# EAGLE design STM32F303CBT6_BTN8962TA_V1_0 (EAGLE 8.0.1)
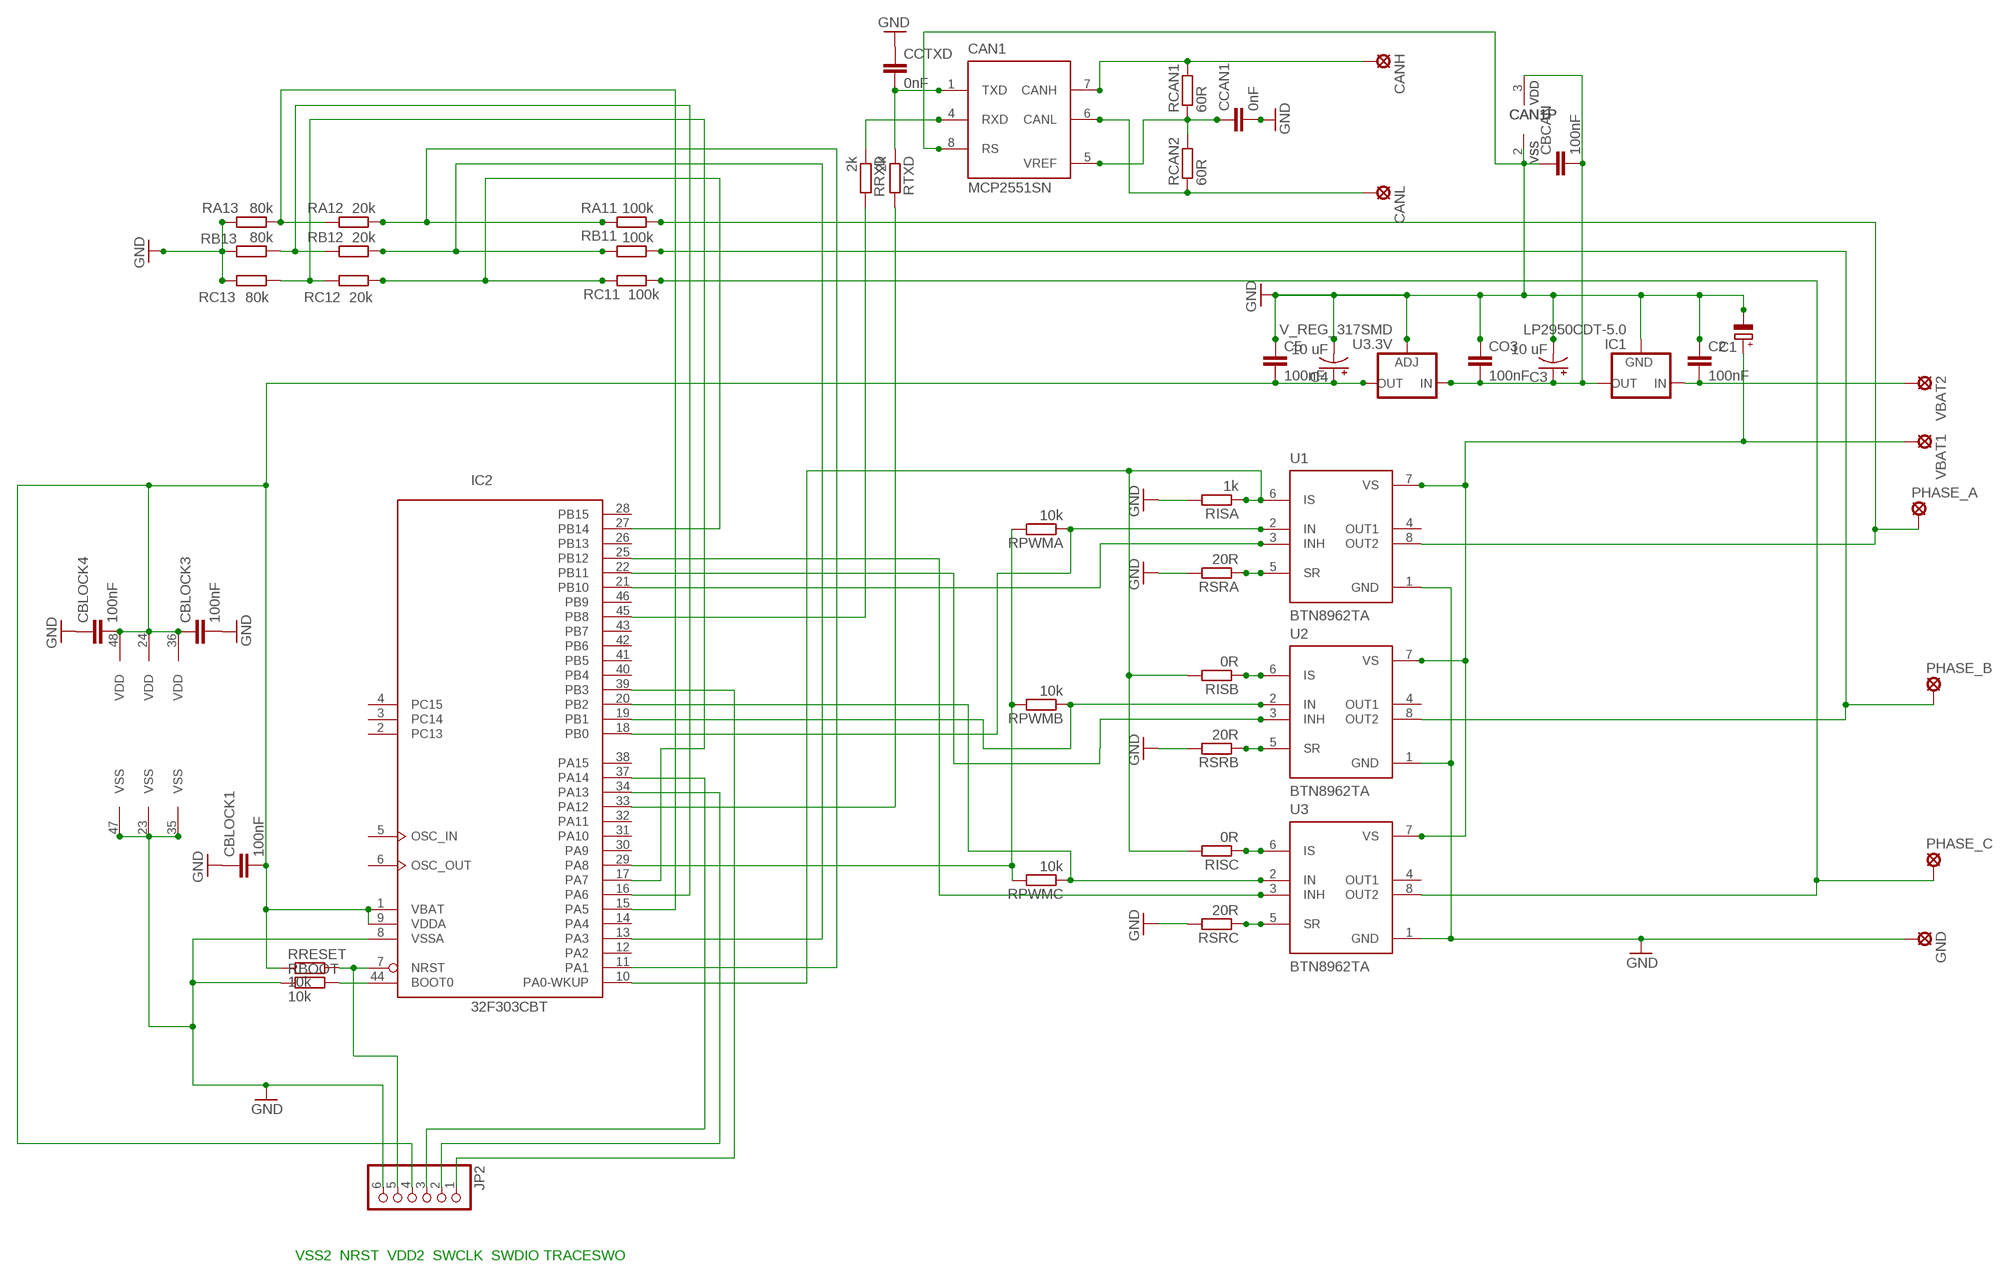
[diagram p0: schematic, sheet 1]

## Parts
C1  CPOL-EUE3.5-10  [E3,5-10]
C2  100nF  C-EUC0805  [C0805]
C3  10 uF  CAP_POLD  [PANASONIC_D]
C4  10 uF  CAP_POLD  [PANASONIC_D]
C5  100nF  C-EUC0805  [C0805]
CAN1  MCP2551SN  [SO-08]
CANH  LSP10  [LSP10]
CANL  LSP10  [LSP10]
CBCAN  100nF  C-EUC0805  [C0805]
CBLOCK1  100nF  C-EUC0805  [C0805]
CBLOCK3  100nF  C-EUC0805  [C0805]
CBLOCK4  100nF  C-EUC0805  [C0805]
CCAN1  0nF  C-EUC0805  [C0805]
CCTXD  0nF  C-EUC0805  [C0805]
CO3  100nF  C-EUC0805  [C0805]
GND  SE14  [SE14]
IC1  LP2950CDT-5.0  [DPACK]
IC2  32F303CBT  STM32F303CBT  [LQFP48]
JP2  PINHD-1X6  [1X06]
PHASE_A  SE14  [SE14]
PHASE_B  SE14  [SE14]
PHASE_C  SE14  [SE14]
RA11  100k  R-EU_R0805  [R0805]
RA12  20k  R-EU_R0805  [R0805]
RA13  80k  R-EU_R0805  [R0805]
RB11  100k  R-EU_R0805  [R0805]
RB12  20k  R-EU_R0805  [R0805]
RB13  80k  R-EU_R0805  [R0805]
RBOOT  10k  R-EU_R0805  [R0805]
RC11  100k  R-EU_R0805  [R0805]
RC12  20k  R-EU_R0805  [R0805]
RC13  80k  R-EU_R0805  [R0805]
RCAN1  60R  R-EU_R0805  [R0805]
RCAN2  60R  R-EU_R0805  [R0805]
RISA  1k  R-EU_R0805  [R0805]
RISB  0R  R-EU_R0805  [R0805]
RISC  0R  R-EU_R0805  [R0805]
RPWMA  10k  R-EU_R0805  [R0805]
RPWMB  10k  R-EU_R0805  [R0805]
RPWMC  10k  R-EU_R0805  [R0805]
RRESET  10k  R-EU_R0805  [R0805]
RRXD  2k  R-EU_R0805  [R0805]
RSRA  20R  R-EU_R0805  [R0805]
RSRB  20R  R-EU_R0805  [R0805]
RSRC  20R  R-EU_R0805  [R0805]
RTXD  2k  R-EU_R0805  [R0805]
U1  BTN8962TA  [TO127P1500X440-8N-1]
U2  BTN8962TA  [TO127P1500X440-8N-1]
U3  BTN8962TA  [TO127P1500X440-8N-1]
U3.3V  V_REG_317SMD  [SOT223]
VBAT1  SE14  [SE14]
VBAT2  SE14  [SE14]

## Nets
A: IC2.11(PA1) RA11.2 RA12.1
B: IC2.13(PA3) RB11.2 RB12.1
C: IC2.27(PB14) RC11.2 RC12.1
GND: C1.- C2.1 C3.- C4.- C5.1 CAN1.2(VSS) CAN1.8(RS) CBCAN.1 CBLOCK1.1 CBLOCK3.2 CBLOCK4.1 CCAN1.2 CCTXD.1 CO3.1 GND.MP IC1.4(GND) IC2.8(VSSA) IC2.23(VSS) IC2.35(VSS) IC2.47(VSS) JP2.6 RA13.2 RB13.2 RBOOT.1 RC13.2 RISA.2 RSRA.2 RSRB.2 RSRC.2 U1.1(GND) U2.1(GND) U3.1(GND) U3.3V.1(ADJ)
N$1: PHASE_A.MP RA11.1 U1.8(OUT2)
N$2: PHASE_B.MP RB11.1 U2.8(OUT2)
N$3: PHASE_C.MP RC11.1 U3.8(OUT2)
N$4: C1.+ U1.7(VS) U2.7(VS) U3.7(VS) VBAT1.MP
N$5: IC2.45(PB8) RRXD.2
N$6: RSRA.1 U1.5(SR)
N$7: RISB.1 U2.6(IS)
N$8: RSRB.1 U2.5(SR)
N$9: RISC.1 U3.6(IS)
N$10: IC2.10(PA0-WKUP) RISA.1 RISB.2 RISC.2 U1.6(IS)
N$11: RSRC.1 U3.5(SR)
N$15: IC2.39(PB3) JP2.1
N$17: IC2.19(PB1) RPWMB.1 U2.2(IN)
N$18: IC2.20(PB2) RPWMC.1 U3.2(IN)
N$19: IC2.25(PB12) U3.3(INH)
N$20: IC2.29(PA8) RPWMA.2 RPWMB.2 RPWMC.2
N$21: IC2.22(PB11) U2.3(INH)
N$22: IC2.21(PB10) U1.3(INH)
N$23: IC2.18(PB0) RPWMA.1 U1.2(IN)
N$27: IC2.34(PA13) JP2.2
N$28: IC2.37(PA14) JP2.3
N$32: IC2.33(PA12) RTXD.2
N$33: CAN1.4(RXD) RRXD.1
N$34: CAN1.6(CANL) CANL.MP RCAN2.1
N$36: CAN1.1(TXD) CCTXD.2 RTXD.1
N$37: CAN1.5(VREF) CCAN1.1 RCAN1.1 RCAN2.2
N$38: IC2.44(BOOT0) RBOOT.2
N$39: C2.2 IC1.1(IN) VBAT2.MP
N$40: CAN1.7(CANH) CANH.MP RCAN1.2
N$42: IC2.17(PA7) RC12.2 RC13.1
N$43: IC2.16(PA6) RB12.2 RB13.1
N$45: IC2.15(PA5) RA12.2 RA13.1
N$54: IC2.7(NRST) JP2.5 RRESET.2
V50: C3.+ CAN1.3(VDD) CBCAN.2 CO3.2 IC1.3(OUT) U3.3V.3(IN)
VDD: C4.+ C5.2 CBLOCK1.2 CBLOCK3.1 CBLOCK4.2 IC2.1(VBAT) IC2.9(VDDA) IC2.24(VDD) IC2.36(VDD) IC2.48(VDD) JP2.4 RRESET.1 U3.3V.2(OUT)
Unconnected: IC2.2(PC13) IC2.3(PC14) IC2.4(PC15) IC2.5(OSC_IN) IC2.6(OSC_OUT) IC2.12(PA2) IC2.14(PA4) IC2.26(PB13) IC2.28(PB15) IC2.30(PA9) IC2.31(PA10) IC2.32(PA11) IC2.38(PA15) IC2.40(PB4) IC2.41(PB5) IC2.42(PB6) IC2.43(PB7) IC2.46(PB9) U1.4(OUT1) U2.4(OUT1) U3.4(OUT1)

## Notes on the sheet
- VSS2  NRST  VDD2  SWCLK  SWDIO TRACESWO

## Library data of the parts
C1 = rcl:CPOL-EU: POLARIZED CAPACITOR, European symbol
C2 C5 CBCAN CBLOCK1 CBLOCK3 CBLOCK4 CCAN1 CCTXD CO3 = rcl:C-EU: CAPACITOR, European symbol
C3 C4 = SparkFun-Capacitors:CAP_POL: Capacitor Polarized These are standard SMD and PTH capacitors. Normally 10uF, 47uF, and 100uF in electrolytic and tantalum varieties. Always verify the external diameter of the through hole cap, it varies with capacity, voltage, and manufacturer. The EIA devices should be standard.
CAN1 = microchip_can:MCP2551: High Speed CAN tranceiver
CANH CANL = solpad:LSP10: SOLDER PAD drill 1.0 mm, distributor Buerklin, 12H555
GND PHASE_A PHASE_B PHASE_C VBAT1 VBAT2 = solpad:SE14: SOLDER PAD E1553, drill 1,4mm, distributor Buerklin, 07F820
IC1 = v-reg:LP2950?*: Source: http://cache.national.com/ds/LP/LP2950.pdf
IC2 = micro-stm_v2:STM32F303C*T: ARM 32-bit Cortex™-M3 CPU 72 MHz maximum frequency 128 to 256 Kbytes of Flash memory 32 to 40 kbytes of SRAM 37 GPIOs 2.0 to 3.6 V application supply
JP2 = adafruit:PINHD-1X6: PIN HEADER
RA11-RA13 RB11-RB13 RBOOT RC11-RC13 RCAN1 RCAN2 RISA RISB RISC RPWMA RPWMB RPWMC RRESET RRXD RSRA RSRB RSRC RTXD = rcl:R-EU_: RESISTOR, European symbol
U1-U3 = BTN8962TA:BTN8962TA: BTN8962TA High Current PN Half Bridge NovalithIC TO127P1500X440-8N-1
U3.3V = SparkFun-PowerIC:V_REG_317: Voltage Regulator Standard LM317 adjustable voltage regulator. AOI (Adjust Output Input). Google 'LM317 Calculator' for easy to use app to get the two resistor values needed. 240/720 for 5V output. 240/390 for 3.3V output. Spark Fun Electronics SKU : COM-00527

## Net classes
0 default: clearance 0.205 mm

## Board
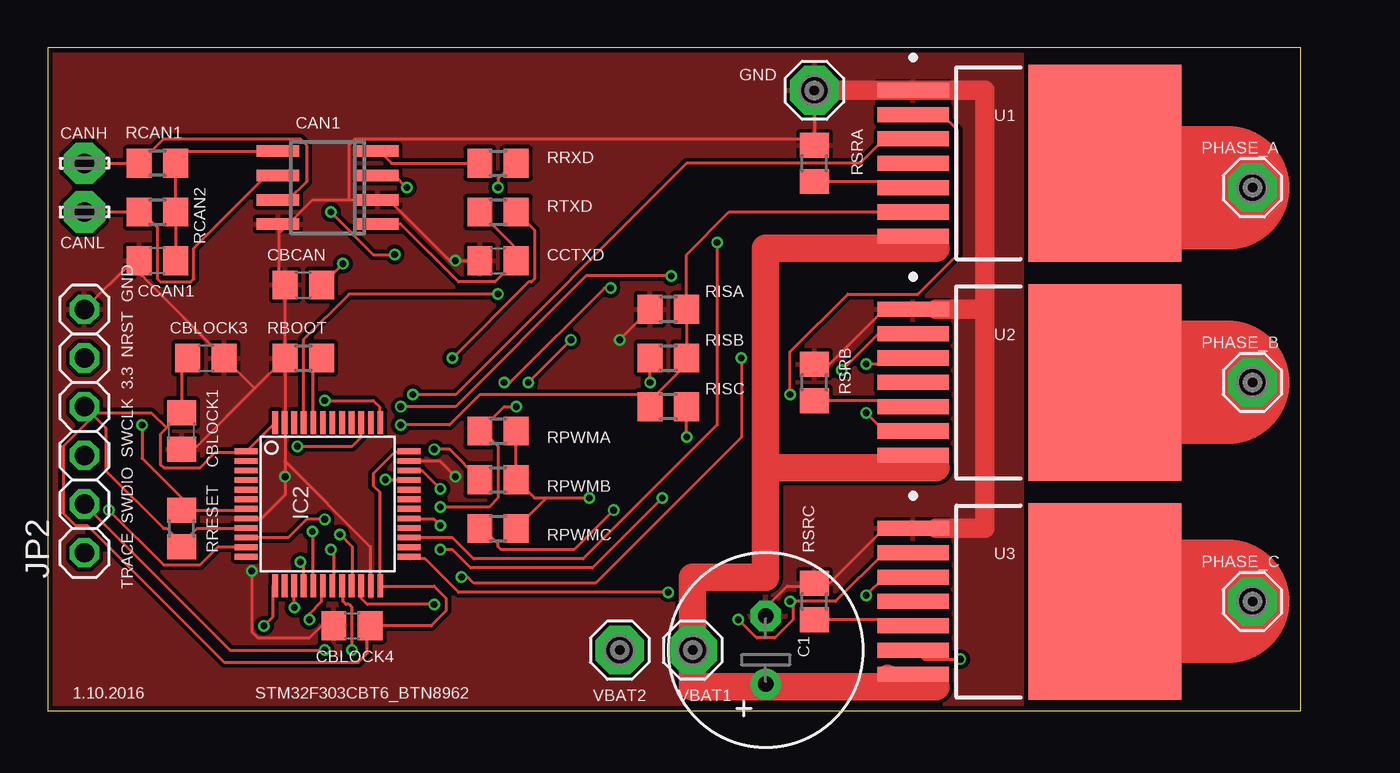
[diagram p1: board, top side]
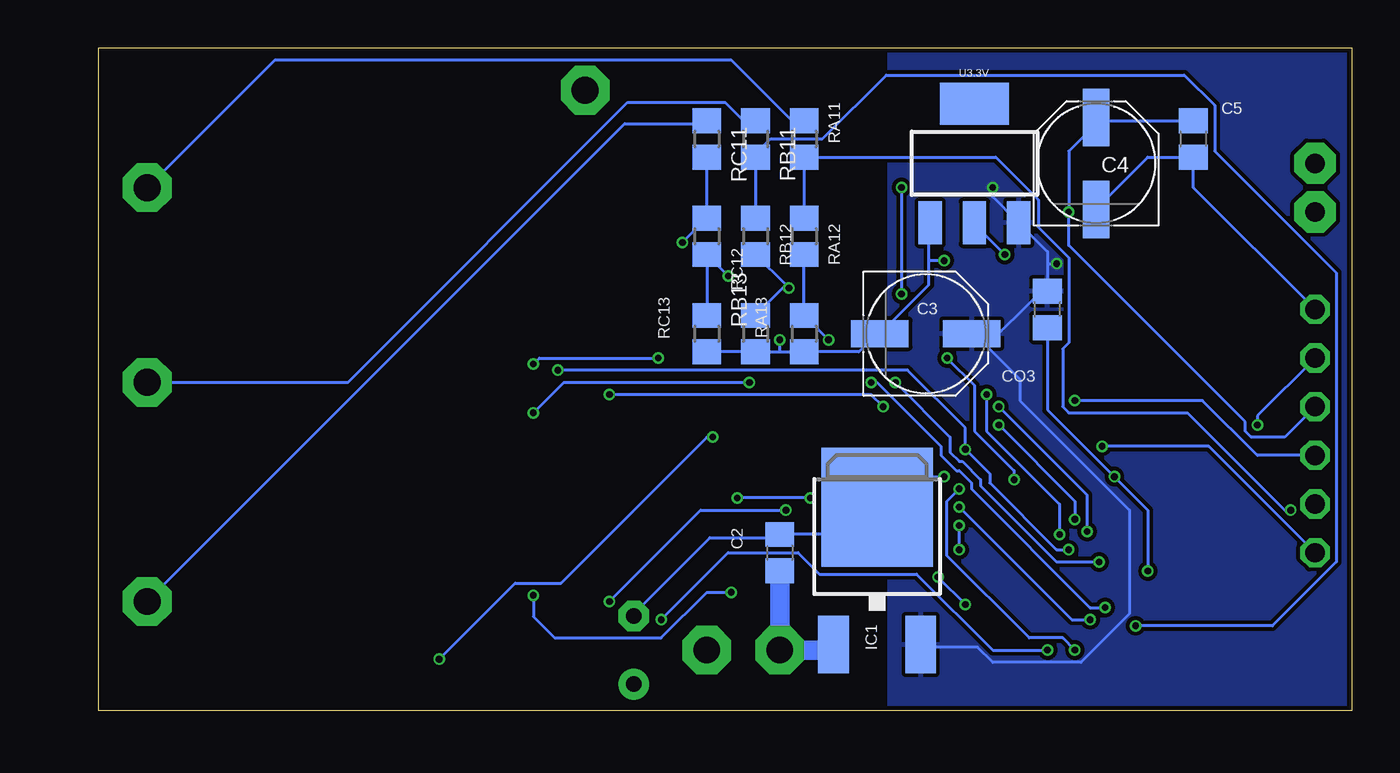
[diagram p2: board, bottom side, seen from below]

Size 65.39 x 34.59 mm. Coordinates in mm from the lower left corner, seen from the top.
Outline: 0,0 65.39,0 65.39,34.59 0,34.59 0,0
Copper layers (1*16): Top 0.018mm / dielectric 1.55mm / Bottom 0.018mm
Design rules "eC_2Layer_PClass6_BaseCopperO18_eCDefault": minimum track width 0.15mm, minimum drill 0.35mm, track to track 0.15mm, track to pad 0.15mm, pad to pad 0.15mm, via to via 0.15mm, smd to smd 0mil, copper to edge 0.25mm, drill to drill 0.35mm, minimum pad ring 0.175mm, minimum via ring 0.125mm, stop-mask expansion 0mil, vias tented up to drill 0.45mm, thermal gap 0.2mm

### Footprints (pad centres in the part's own frame; a part is rotated, then mirrored left to right if it is on the bottom)
E3,5-10 = drill 0.813 pad 1.6: + -1.778,0 | drill 0.813 pad 1.6 octagon: - 1.778,0
C0805 = smd 1.3 x 1.5: 1 -0.95,0; 2 0.95,0
PANASONIC_D = smd 3 x 1.4: + 2.4,0; - -2.4,0
SO-08 = smd 0.6 x 2.2: 1 -1.905,-2.6; 2 -0.635,-2.6; 3 0.635,-2.6; 4 1.905,-2.6; 5 1.905,2.6; 6 0.635,2.6; 7 -0.635,2.6; 8 -1.905,2.6
LSP10 = drill 1.016 pad 2.159 octagon: MP 0,0
SE14 = drill 1.397 pad 2.54 octagon: MP 0,0
DPACK = smd 1.6 x 3: 1 -2.28,-4.8; 3 2.28,-4.8 | smd 5.8 x 6.2: 4 0,2.38
LQFP48 = smd 0.3 x 1.2: 1 -2.75,-4.25; 2 -2.25,-4.25; 3 -1.75,-4.25; 4 -1.25,-4.25; 5 -0.75,-4.25; 6 -0.25,-4.25; 7 0.25,-4.25; 8 0.75,-4.25; 9 1.25,-4.25; 10 1.75,-4.25; 11 2.25,-4.25; 12 2.75,-4.25; 25 2.75,4.25; 26 2.25,4.25; 27 1.75,4.25; 28 1.25,4.25; 29 0.75,4.25; 30 0.25,4.25; 31 -0.25,4.25; 32 -0.75,4.25; 33 -1.25,4.25; 34 -1.75,4.25; 35 -2.25,4.25; 36 -2.75,4.25 | smd 1.2 x 0.3: 13 4.25,-2.75; 14 4.25,-2.25; 15 4.25,-1.75; 16 4.25,-1.25; 17 4.25,-0.75; 18 4.25,-0.25; 19 4.25,0.25; 20 4.25,0.75; 21 4.25,1.25; 22 4.25,1.75; 23 4.25,2.25; 24 4.25,2.75; 37 -4.25,2.75; 38 -4.25,2.25; 39 -4.25,1.75; 40 -4.25,1.25; 41 -4.25,0.75; 42 -4.25,0.25; 43 -4.25,-0.25; 44 -4.25,-0.75; 45 -4.25,-1.25; 46 -4.25,-1.75; 47 -4.25,-2.25; 48 -4.25,-2.75
1X06 = drill 1.016 octagon: 1 -6.35,0; 2 -3.81,0; 3 -1.27,0; 4 1.27,0; 5 3.81,0; 6 6.35,0
R0805 = smd 1.3 x 1.5: 1 -0.95,0; 2 0.95,0
TO127P1500X440-8N-1 = smd 3.708 x 0.787: 1 -5.004,3.81; 2 -5.004,2.54; 3 -5.004,1.27; 4 -5.004,0; 5 -5.004,-1.27; 6 -5.004,-2.54; 7 -5.004,-3.81 | smd 8.001 x 10.262: 8 5.004,0
SOT223 = smd 1.219 x 2.235: 1 -2.311,-3.099; 2 0,-3.099; 3 2.311,-3.099 | smd 3.6 x 2.2: 4 0,3.099

### Placement (x,y rotation side)
C1  37.47,3.17 90 top
C2  29.84,8.26 270 bottom
C3  22.23,19.68 0 bottom
C4  13.34,28.57 90 bottom
C5  8.26,29.84 90 bottom
CAN1  14.61,27.3 90 top
CANH  1.91,28.57 0 top
CANL  1.91,26.04 0 top
CBCAN  13.34,22.23 0 top
CBLOCK1  6.99,14.61 90 top
CBLOCK3  8.26,18.41 0 top
CBLOCK4  15.88,4.45 0 top
CCAN1  5.71,23.5 180 top
CCTXD  23.5,23.5 0 top
CO3  15.88,20.95 90 bottom
GND  40.01,32.38 0 top
IC1  24.77,8.26 0 bottom
IC2  14.61,10.79 270 top
JP2  1.91,14.61 90 top
PHASE_A  62.87,27.3 0 top
PHASE_B  62.87,17.14 0 top
PHASE_C  62.87,5.71 0 top
RA11  28.57,29.84 270 bottom
RA12  28.57,24.77 270 bottom
RA13  28.57,19.68 270 bottom
RB11  31.11,29.84 270 bottom
RB12  31.11,24.77 270 bottom
RB13  31.11,19.68 270 bottom
RBOOT  13.34,18.41 0 top
RC11  33.66,29.84 270 bottom
RC12  33.66,24.77 270 bottom
RC13  33.66,19.68 270 bottom
RCAN1  5.71,28.57 180 top
RCAN2  5.71,26.04 0 top
RISA  32.38,20.95 180 top
RISB  32.38,18.41 0 top
RISC  32.38,15.88 180 top
RPWMA  23.5,14.61 0 top
RPWMB  23.5,12.06 0 top
RPWMC  23.5,9.53 0 top
RRESET  6.99,9.53 90 top
RRXD  23.5,28.57 0 top
RSRA  40.01,28.57 90 top
RSRB  40.01,17.14 90 top
RSRC  40.01,5.71 90 top
RTXD  23.5,26.04 0 top
U1  50.16,28.57 0 top
U2  50.16,17.14 0 top
U3  50.16,5.71 0 top
U3.3V  19.68,28.57 0 bottom
VBAT1  33.66,3.17 0 top
VBAT2  29.84,3.17 0 top

### Tracks (layer width: path | path; a pad name or v marks a point on that pad's centre or on a via)
A  (via drill 0.35)
  Top 0.15: v3.17,10.48 6.03,7.62 7.94,7.62 8.89,8.57 10.32,8.57 IC2.11
  Bottom 0.15: v3.17,10.48 3.49,10.48 8.57,15.56 14.76,15.56 15.08,15.88 15.08,18.89 14.76,19.21 14.76,23.65 16.35,25.24 16.35,26.67 18.57,28.89 RA11.2 | RA11.2 RA12.1 | RA11.2
B  (via drill 0.35)
  Top 0.15: v11.27,4.45 11.75,4.92 11.75,6.51 IC2.13
  Bottom 0.15: v11.27,4.45 4.13,4.45 0.79,7.78 0.79,22.86 7.14,29.21 7.14,31.59 8.73,33.18 24.29,33.18 27.62,29.84 30.32,29.84 31.11,29.05 RB11.2 RB12.1
C  (via drill 0.35)
  Top 0.15: v34.92,24.45 34.92,14.92 27.94,7.94 22.23,7.94 21.11,9.05 18.89,9.05 IC2.27
  Bottom 0.15: RC12.1 v34.92,24.45 | RC12.1 RC11.2 | RC12.1
GND  (via drill 0.35)
  Top 0.15: 45.24,32.38 U1.1 45.09,32.38 | v21.27,12.22 20.48,13.02 18.89,13.02 IC2.35 | RSRB.2 40.8,18.1 43.66,20.95 U2.1 46.35,20.95 | C1.- 37.47,5.4 38.58,6.51 40.01,6.51 RSRC.2 40.8,6.67 43.66,9.53 U3.1 46.35,9.53 | GND.MP 40.01,29.84 | 40.01,29.84 RSRA.2 | CBLOCK4.1 14.29,4.45 13.65,3.81 10.95,3.81 10.64,4.13 v10.64,7.3 | v29.84,19.37 RISA.2 | 12.38,13.02 12.38,14.92 IC2.47 12.38,15.08 RBOOT.1 | 12.38,13.02 v12.38,12.22 12.38,11.27 11.11,10 10.48,10 IC2.8 | 12.38,13.02 16.83,8.57 16.83,6.67 IC2.23 | CCTXD.1 v21.27,23.5 20.95,23.5 17.78,26.67 CAN1.2 15.72,26.67 | JP2.6 4.45,23.5 CCAN1.2 4.92,23.5 4.92,22.7 CBLOCK3.2 | RBOOT.1 10.79,16.83 | 10.79,16.83 7.78,13.81 6.99,13.81 CBLOCK1.1 | 10.79,16.83 CBLOCK3.2 | RBOOT.1 CBCAN.1 | 12.06,24.92 12.06,22.54 CBCAN.1 | 12.06,24.92 12.06,25.4 CAN1.8 | CBCAN.1 | CBLOCK3.2 | 15.72,26.67 13.81,26.67 12.06,24.92 | RBOOT.1 | 40.01,29.84 16.03,29.84 15.72,29.53 15.72,26.67
  Top 1.016: GND.MP 45.09,32.38 48.9,32.38 48.9,20.95 | 48.9,20.95 48.9,9.53 46.35,9.53 | 46.35,20.95 48.9,20.95
  Bottom 0.15: v21.27,12.22 23.18,12.22 IC1.4 24.77,10.48 26.04,9.21 C2.1 29.84,9.05 33.5,9.05 37.47,5.08 C1.- | v10.64,7.3 10.64,10.48 v12.38,12.22 15.88,15.72 CO3.1 | RB13.2 29.84,18.73 | 29.84,18.73 RA13.2 | 29.84,18.73 v29.84,19.37 | RB13.2 RC13.2 | RB13.2 | 22.07,23.5 22.07,22.23 24.61,19.68 C3.- 24.77,19.68 25.72,18.73 RA13.2 | 22.07,23.5 22.07,25.4 U3.3V.1 | RA13.2 | C5.1 10.64,28.89 13.34,26.19 C4.- | C5.1 8.26,27.3 JP2.6 | C5.1 | v21.27,23.5 22.07,23.5
  pour Top: 0,34.29 50.8,34.29 50.8,-1.27 -1.27,-1.27 -1.27,0 -2.54,0 -2.54,34.29
N$1
  Top 0.15: PHASE_A.MP 61.59,27.3 | U1.8 55.24,28.57 57.78,27.3
  Top 6.452: 57.78,27.3 61.59,27.3
  Bottom 0.15: PHASE_A.MP 56.2,33.97 32.38,33.97 29.21,30.8 RA11.1
N$2
  Top 0.15: PHASE_B.MP 61.59,17.14 | U2.8 55.24,17.14 57.78,17.14
  Top 6.452: 57.78,17.14 61.59,17.14
  Bottom 0.15: PHASE_B.MP 52.39,17.14 37.78,31.75 32.7,31.75 31.75,30.8 RB11.1
N$3
  Top 0.15: PHASE_C.MP 61.59,5.71 | U3.8 55.24,5.71 57.78,5.71
  Top 6.452: 57.78,5.71 61.59,5.71
  Bottom 0.15: PHASE_C.MP 37.94,30.64 33.66,30.64 RC11.1
N$4
  Top 0.15: 45.24,1.91 U3.7 45.09,1.91 45.09,1.27 | 37.47,1.43 C1.+ 37.47,1.27 | U2.7 45.24,13.34 45.24,12.7 | U1.7 45.24,24.77 45.24,24.13
  Top 1.016: 46.35,1.27 43.81,1.91
  Top 1.422: 46.35,24.13 45.24,24.13 37.47,24.13 37.47,12.7 | 37.47,12.7 37.47,6.99 33.66,6.99 VBAT1.MP 33.66,1.27 37.47,1.27 45.09,1.27 46.35,1.27 | 37.47,12.7 45.24,12.7 46.35,12.7
N$5  (via drill 0.35)
  Top 0.15: v23.5,21.75 15.72,21.75 13.34,19.37 13.34,15.08 IC2.45 | v23.5,27.3 23.5,27.78 24.29,28.57 RRXD.2
  Bottom 0.15: v23.5,27.3 v23.5,21.75
N$6
  Top 0.15: RSRA.1 44.77,27.62 45.09,27.3 U1.5
N$7  (via drill 0.35)
  Top 0.15: v31.43,17.14 RISB.1 | v42.7,15.56 43.66,14.61 U2.6
  Bottom 0.15: v31.43,17.14 41.12,17.14 v42.7,15.56
N$8
  Top 0.15: RSRB.1 44.77,16.19 45.09,15.88 U2.5
N$9  (via drill 0.35)
  Top 0.15: v33.34,14.29 RISC.1 | v47.62,2.7 45.72,2.7 45.24,3.17 U3.6
  Bottom 0.15: v33.34,14.29 33.66,14.29 41.27,6.67 43.66,6.67 v47.62,2.7
N$10  (via drill 0.35)
  Top 0.15: RISA.1 RISB.2 33.18,18.41 33.18,17.94 31.27,16.03 | v14.45,10 13.49,10 12.54,9.05 10.48,9.05 IC2.10 | v18.41,14.92 20.95,14.92 22.54,16.51 30.8,16.51 31.27,16.03 | 31.27,16.03 RISC.2 31.27,16.03 | U1.6 35.56,26.04 33.34,23.81 RISA.1 | RISA.1
  Bottom 0.15: v14.45,10 14.45,10.95 v18.41,14.92
N$11
  Top 0.15: RSRC.1 44.77,4.76 45.09,4.45 U3.5
N$15  (via drill 0.35)
  Top 0.15: v13.02,13.81 15.88,13.81 16.35,14.29 16.35,14.92 IC2.39
  Bottom 0.15: v13.02,13.81 7.46,13.81 JP2.1
N$17  (via drill 0.35)
  Top 0.15: v14.76,8.41 14.92,8.26 14.92,6.67 IC2.19 | v20.16,13.65 20.95,13.65 RPWMB.1 | U2.2 43.34,19.68 v41.43,17.78
  Bottom 0.15: v14.76,8.41 15.4,8.41 18.89,11.91 18.89,12.38 v20.16,13.65 20.16,14.76 23.18,17.78 v41.43,17.78
N$18  (via drill 0.35)
  Top 0.15: v15.88,3.17 15.88,5.4 15.72,5.56 15.56,5.56 15.4,5.71 15.4,6.51 IC2.20 | v36.04,4.76 36.99,3.81 37.94,3.81 38.89,4.76 38.89,5.56 | 38.89,5.56 39.05,5.71 41.12,5.71 43.66,8.26 U3.2 | v29.53,10.48 27.46,8.41 23.65,8.41 23.5,8.57 23.5,8.73 22.7,9.53 RPWMC.1 | 38.89,5.56 v38.73,5.71
  Bottom 0.15: v15.88,3.17 18.73,3.17 22.7,7.14 27.78,7.14 28.89,8.26 32.54,8.26 v36.04,4.76 | v29.53,10.48 33.97,10.48 v38.73,5.71
N$19  (via drill 0.35)
  Top 0.15: v32.38,6.19 21.43,6.19 19.68,7.94 18.89,7.94 IC2.25 | v42.7,6.03 43.66,6.99 U3.3
  Bottom 0.15: v32.38,6.19 33.66,6.19 36.04,3.81 41.59,3.81 42.7,4.92 v42.7,6.03
N$20  (via drill 0.35)
  Top 0.15: v20.48,9.68 20.16,10 18.89,10 IC2.29 | v20.48,8.41 21.11,8.41 22.07,7.46 28.42,7.46 v32.07,11.11 | 26.04,11.11 25.4,11.11 RPWMB.2 | 26.04,11.11 v28.26,11.11 | 26.04,11.11 RPWMC.2 | RPWMB.2 RPWMA.2 | RPWMB.2
  Bottom 0.15: v20.48,8.41 v20.48,9.68 | v28.26,11.11 v32.07,11.11
N$21  (via drill 0.35)
  Top 0.15: v20.16,5.56 16.67,5.56 16.35,5.87 16.35,6.51 IC2.22 | v21.59,6.99 21.91,6.99 22.23,6.67 28.57,6.67 36.2,14.29 v36.2,18.41 | v42.7,18.1 44.77,18.1 45.09,18.41 U2.3
  Bottom 0.15: v21.59,6.99 v20.16,5.56 | v36.2,18.41 42.39,18.41 v42.7,18.1
N$22  (via drill 0.35)
  Top 0.15: v15.24,9.21 15.88,8.57 15.88,6.67 IC2.21 | v19.05,16.51 21.27,16.51 33.34,28.57 42.39,28.57 43.66,29.84 U1.3
  Bottom 0.15: v15.24,9.21 15.24,10.79 19.05,14.61 v19.05,16.51
N$23  (via drill 0.35)
  Top 0.15: v13.65,4.76 13.65,5.08 14.29,5.71 14.29,6.51 IC2.18 | v20.48,10.64 23.02,10.64 23.5,11.11 23.5,13.81 22.7,14.61 RPWMA.1 23.81,15.88 v24.45,15.88 | U1.2 46.67,31.11 47.47,30.32 47.47,23.81 45.4,21.75 41.75,21.75 38.73,18.73 v38.73,16.51
  Bottom 0.15: v13.65,4.76 14.61,4.76 v20.48,10.64 | v38.73,16.51 25.08,16.51 v24.45,15.88
N$27  (via drill 0.35)
  Top 0.15: v20.48,11.59 19.53,12.54 18.89,12.54 IC2.34 | v14.45,3.17 9.53,3.17 JP2.2
  Bottom 0.15: v20.48,11.59 21.11,10.95 21.11,8.1 16.83,3.81 15.08,3.81 v14.45,3.17
N$28  (via drill 0.35)
  Top 0.15: v14.45,16.19 16.99,16.19 17.3,15.88 17.3,15.08 IC2.37
  Bottom 0.15: v14.45,16.19 7.78,16.19 4.92,13.34 JP2.3
N$32  (via drill 0.35)
  Top 0.15: v17.62,12.06 18.73,12.06 IC2.33 | v21.11,18.41 25.08,22.38 25.24,22.38 25.4,22.54 25.4,25.08 RTXD.2
  Bottom 0.15: v17.62,12.06 17.62,12.54 19.68,14.61 19.68,16.99 v21.11,18.41
N$33
  Top 0.15: RRXD.1 17.94,28.57 17.3,29.21 CAN1.4
N$34
  Top 0.15: CANL.MP RCAN2.1 4.92,26.04 5.71,25.24 5.71,22.54 5.87,22.38 7.46,22.38 7.62,22.54 7.62,24.13 11.43,27.94 CAN1.6
N$36
  Top 0.15: RTXD.1 24.29,24.29 24.29,23.5 CCTXD.2 23.34,22.38 21.43,22.38 18.41,25.4 CAN1.1
N$37
  Top 0.15: RCAN2.2 CCAN1.1 | RCAN2.2 RCAN1.1 | RCAN2.2 | CAN1.5 7.3,29.21 RCAN1.1 | RCAN1.1
N$38
  Top 0.15: IC2.44 13.81,15.08 13.81,18.1 14.13,18.41 RBOOT.2
N$39
  Bottom 0.15: C2.2 29.84,6.99 | 27.3,3.17 27.15,3.33 IC1.1
  Bottom 1.016: 27.3,3.17 VBAT2.MP 29.84,6.99
N$40
  Top 0.15: CANH.MP RCAN1.2 | CAN1.7 12.54,26.67 13.49,27.62 13.49,29.53 13.18,29.84 6.03,29.84 RCAN1.2 | RCAN1.2
N$42  (via drill 0.35)
  Top 0.15: v13.81,9.37 13.81,6.67 IC2.17 | v18.41,15.88 21.27,15.88 28.1,22.7 v32.54,22.7
  Bottom 0.15: v13.81,9.37 13.81,11.27 v18.41,15.88 | RC12.2 v32.54,22.7 | RC12.2 RC13.1 | RC12.2
N$43  (via drill 0.35)
  Top 0.15: v13.18,7.78 13.34,7.62 13.34,6.67 IC2.16 | v23.81,17.14 24.13,17.14 29.05,22.07 v29.37,22.07
  Bottom 0.15: v13.18,7.78 15.4,7.78 19.37,11.75 19.37,12.06 20.32,13.02 20.48,13.02 20.95,13.49 20.95,14.29 v23.81,17.14 | 29.53,22.23 RB12.2 | 29.53,22.23 RB13.1 | 29.53,22.23 v29.37,22.07
N$45  (via drill 0.35)
  Top 0.15: v12.86,5.4 12.86,6.51 IC2.15 | v27.3,19.37 v25.08,17.14
  Bottom 0.15: v12.86,5.4 13.65,5.4 19.84,11.59 19.84,11.91 20.48,12.54 20.64,12.54 21.43,13.34 21.43,13.81 24.77,17.14 v25.08,17.14 | RA13.1 v27.3,19.37 | RA13.1 RA12.2 | RA13.1
N$54  (via drill 0.35)
  Top 0.15: RRESET.2 10.32,10.48 IC2.7 | RRESET.2 6.99,11.11 4.92,13.18 v4.92,14.92 | RRESET.2
  Bottom 0.15: v4.92,14.92 4.92,15.4 JP2.5
V50  (via drill 0.35)
  Top 0.15: v15.4,23.34 CBCAN.2 | CAN1.3 18.1,27.94 v18.73,27.3
  Bottom 0.15: 15.88,23.34 15.88,23.97 17.3,25.4 U3.3V.3 17.46,25.56 18.73,26.83 v18.73,27.3 | 15.88,23.34 CO3.2 15.88,21.75 16.35,21.75 19.05,19.05 | 15.88,23.34 v15.4,23.34 | 19.05,19.05 19.68,19.68 C3.+ 19.05,19.05 | 19.05,19.05 17.3,17.3 17.3,16.19 11.59,10.48 11.59,5.08 14.13,2.54 18.73,2.54 19.53,3.33 22.38,3.33 IC1.3
  pour Bottom: 0,34.29 24.13,34.29 24.13,0 0,0
VDD  (via drill 0.35)
  Top 0.15: v18.1,23.81 16.99,23.81 v14.76,26.04 | IC2.36 18.73,13.49 18.1,13.49 16.99,12.38 16.99,11.75 17.3,11.43 17.3,6.67 IC2.24 17.46,6.51 20.16,6.51 20.8,5.87 20.8,5.24 20,4.45 CBLOCK4.2 16.67,4.45 16.67,3.02 16.19,2.54 9.21,2.54 2.06,9.68 1.43,9.68 0.79,10.32 0.79,13.81 2.38,15.4 | IC2.48 11.75,14.92 10.48,13.65 IC2.1 10.32,13.49 8.73,13.49 7.94,12.7 6.03,12.7 5.87,12.86 5.87,14.45 6.19,14.76 | CBLOCK1.2 6.99,18.1 CBLOCK3.1 | CBLOCK1.2 6.19,14.76 | CBLOCK1.2 | 6.99,8.73 7.78,9.53 10.32,9.53 IC2.9 | 6.99,8.73 6.19,9.53 6.03,9.53 3.02,12.54 3.02,14.76 2.38,15.4 | 2.22,15.56 2.38,15.4 | 6.99,8.73 RRESET.1 | 6.19,14.76 5.4,15.56 2.22,15.56 | 2.22,15.56 JP2.4 2.22,15.56
  Bottom 0.15: 13.18,30.8 C5.2 | 13.18,30.8 13.34,30.96 C4.+ 13.18,30.8 | v18.1,23.81 19.68,25.4 U3.3V.2 | 13.18,30.8 14.76,29.21 v14.76,26.04 14.76,24.29 5.56,15.08 5.56,14.61 5.24,14.29 3.49,14.29 JP2.4

### Text on the board
tNames: TRACE SWDIO SWCLK 3.3 NRST GND | 1.10.2016 | STM32F303CBT6_BTN8962